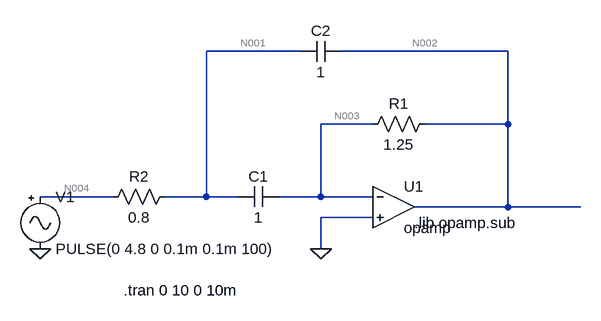
[diagram p0: schematic P4_2.asc]
P4_2.asc, the LTspice schematic file:
Version 4.1
SHEET 1 880 680
WIRE 96 -80 -48 -80
WIRE 416 -80 160 -80
WIRE 208 32 128 32
WIRE 416 32 416 -80
WIRE 416 32 288 32
WIRE -192 144 -304 144
WIRE -48 144 -48 -80
WIRE -48 144 -112 144
WIRE 0 144 -48 144
WIRE 128 144 128 32
WIRE 128 144 64 144
WIRE 208 144 128 144
WIRE 416 160 416 32
WIRE 416 160 272 160
WIRE 528 160 416 160
WIRE 208 176 128 176
WIRE 128 224 128 176
FLAG -304 224 0
FLAG 128 224 0
SYMBOL OpAmps\\opamp 240 96 R0
SYMATTR InstName U1
SYMBOL cap 64 128 R90
WINDOW 0 0 32 VBottom 2
WINDOW 3 32 32 VTop 2
SYMATTR InstName C1
SYMATTR Value 1
SYMBOL cap 160 -96 R90
WINDOW 0 0 32 VBottom 2
WINDOW 3 32 32 VTop 2
SYMATTR InstName C2
SYMATTR Value 1
SYMBOL res 304 16 R90
WINDOW 0 0 56 VBottom 2
WINDOW 3 32 56 VTop 2
SYMATTR InstName R1
SYMATTR Value 1.25
SYMBOL res -96 128 R90
WINDOW 0 0 56 VBottom 2
WINDOW 3 32 56 VTop 2
SYMATTR InstName R2
SYMATTR Value 0.8
SYMBOL Misc\\signal -304 128 R0
WINDOW 123 0 0 Left 0
WINDOW 39 0 0 Left 0
SYMATTR InstName V1
SYMATTR Value PULSE(0 4.8 0 0.1m 0.1m 100)
TEXT -176 288 Left 2 !.tran 0 10 0 10m
TEXT 272 184 Left 2 !.lib opamp.sub

The netlist it stands for:
* P4_2.asc
X§U1 N003 0 N002 opamp Aol=100K GBW=10Meg  ; pins invin noninvin out
C1 N003 N001 1
C2 N002 N001 1
R1 N002 N003 1.25
R2 N001 N004 0.8
V1 N004 0 PULSE(0 4.8 0 0.1m 0.1m 100)
.tran 0 10 0 10m
.lib opamp.sub
.backanno
.end

* Results of the author's LTspice run, read from the files saved beside the schematic
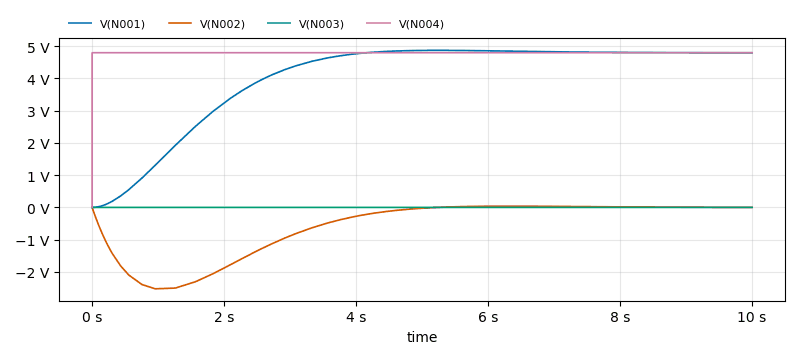
[diagram p1: Transient Analysis of P4_2.asc, plotted from the saved traces]
* Transient Analysis, 1 run:
*   V(N001): min 0 V, max 4.873 V, average 4.032 V, rms 4.27 V, last 4.799 V
*   V(N002): min -2.526 V, max 38.26 mV, average -598.4 mV, rms 1.058 V, last 937.8 µV
*   V(N003): min -1.122 µV, max 74.14 µV, average 15.59 µV, rms 29.55 µV, last 2.563 nV
*   V(N004): min 0 V, max 4.8 V, average 4.8 V, rms 4.8 V, last 4.8 V